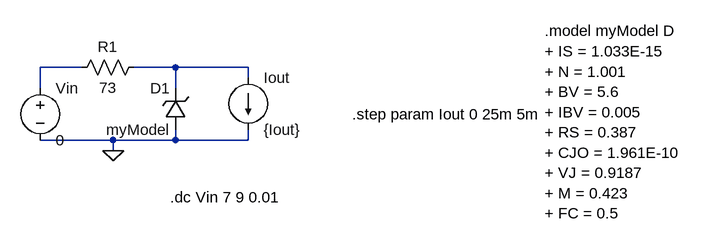
[diagram p0: schematic Draft1.asc]
Draft1.asc, the LTspice schematic file:
Version 4
SHEET 1 940 680
WIRE -16 96 -80 96
WIRE 128 96 64 96
WIRE 240 96 128 96
WIRE 240 112 240 96
WIRE -80 128 -80 96
WIRE 128 128 128 96
WIRE 32 208 -80 208
WIRE 128 208 128 192
WIRE 128 208 32 208
WIRE 240 208 240 192
WIRE 240 208 128 208
WIRE 32 224 32 208
FLAG 32 224 0
SYMBOL zener 144 192 R180
WINDOW 0 24 64 Left 2
WINDOW 3 24 0 Left 2
SYMATTR InstName D1
SYMATTR Value myModel
SYMBOL voltage -80 112 R0
SYMATTR InstName Vin
SYMATTR Value 0
SYMBOL res 80 80 R90
WINDOW 0 0 56 VBottom 2
WINDOW 3 32 56 VTop 2
SYMATTR InstName R1
SYMATTR Value 73
SYMBOL current 240 112 R0
WINDOW 123 0 0 Left 2
WINDOW 39 0 0 Left 2
SYMATTR InstName Iout
SYMATTR Value {Iout}
TEXT 120 296 Left 2 !.dc Vin 7 9 0.01
TEXT 400 168 Left 2 !.step param Iout 0 25m 5m
TEXT 696 40 Left 2 !.model myModel D\n+ IS = 1.033E-15\n+ N = 1.001\n+ BV = 5.6\n+ IBV = 0.005\n+ RS = 0.387\n+ CJO = 1.961E-10\n+ VJ = 0.9187\n+ M = 0.423\n+ FC = 0.5

The netlist it stands for:
* Draft1.asc
D1 0 N002 myModel
Vin N001 0 0
R1 N002 N001 73
Iout N002 0 {Iout}
.model D D
.lib standard.dio
.dc Vin 7 9 0.01
.step param Iout 0 25m 5m
.model myModel D
+ IS = 1.033E-15
+ N = 1.001
+ BV = 5.6
+ IBV = 0.005
+ RS = 0.387
+ CJO = 1.961E-10
+ VJ = 0.9187
+ M = 0.423
+ FC = 0.5
.backanno
.end